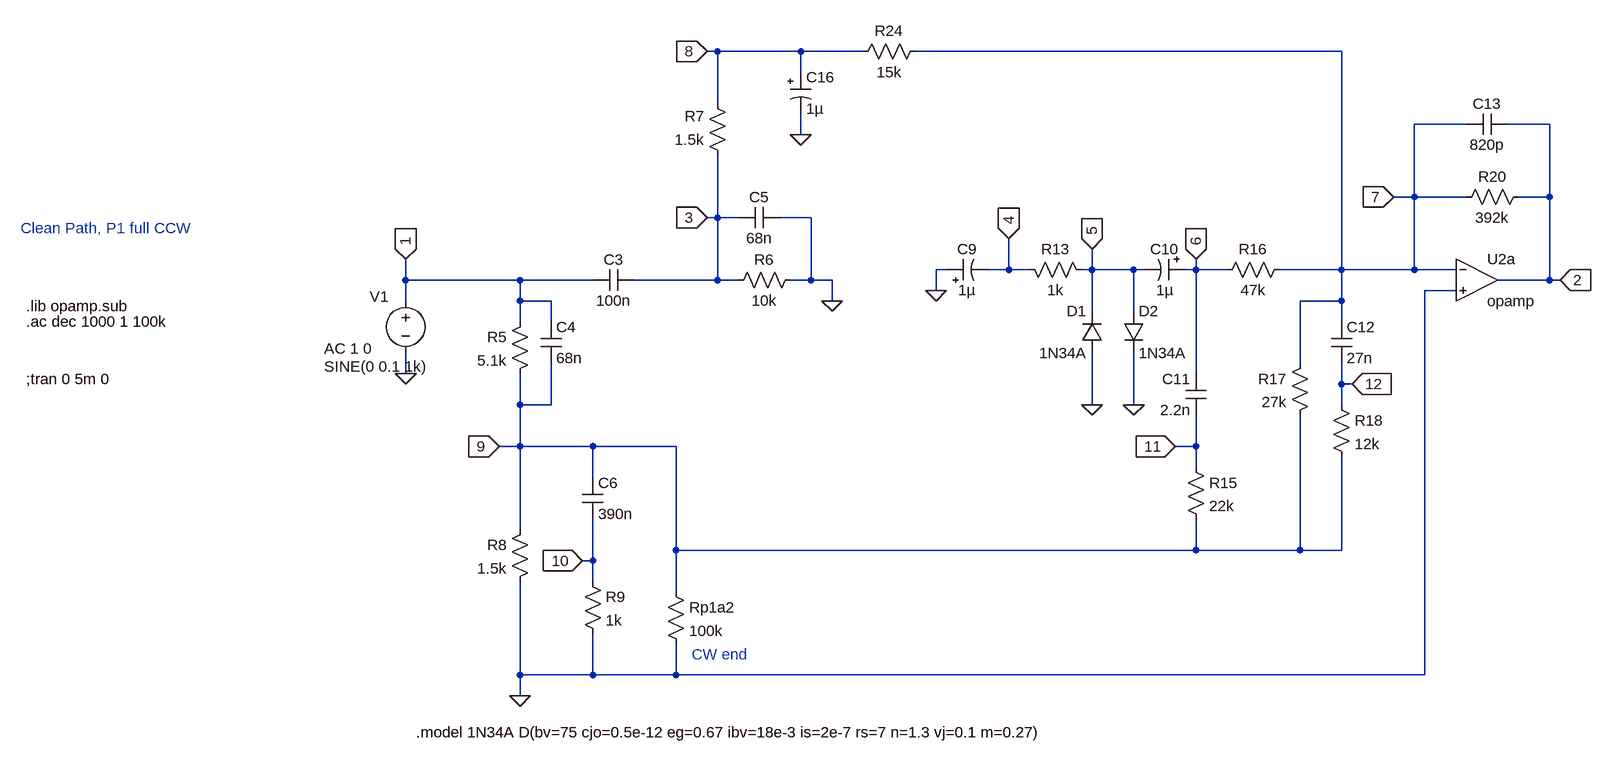
[diagram p0: schematic Klon-Centaur_clean_path_P1_full_ccw_v1.asc]
Klon-Centaur_clean_path_P1_full_ccw_v1.asc, the LTspice schematic file:
Version 4
SHEET 1 4496 5064
WIRE 96 2208 80 2208
WIRE 224 2208 96 2208
WIRE 320 2208 224 2208
WIRE 1056 2208 400 2208
WIRE 224 2240 224 2208
WIRE 96 2288 96 2208
WIRE 1248 2320 1168 2320
WIRE 1376 2320 1312 2320
WIRE 224 2336 224 2304
WIRE 1168 2432 1168 2320
WIRE 1168 2432 1136 2432
WIRE 1248 2432 1168 2432
WIRE 1376 2432 1376 2320
WIRE 1376 2432 1328 2432
WIRE 96 2464 96 2368
WIRE 96 2464 80 2464
WIRE 128 2464 96 2464
WIRE 240 2464 192 2464
WIRE 448 2544 432 2544
WIRE 544 2544 544 2496
WIRE 544 2544 512 2544
WIRE 576 2544 544 2544
WIRE 672 2544 672 2512
WIRE 672 2544 656 2544
WIRE 736 2544 672 2544
WIRE 752 2544 736 2544
WIRE 832 2544 832 2528
WIRE 832 2544 816 2544
WIRE 880 2544 832 2544
WIRE 1056 2544 1056 2208
WIRE 1056 2544 960 2544
WIRE 1168 2544 1168 2432
WIRE 1168 2544 1056 2544
WIRE 1232 2544 1168 2544
WIRE -384 2560 -384 2528
WIRE -208 2560 -384 2560
WIRE -96 2560 -208 2560
WIRE 96 2560 96 2464
WIRE 96 2560 -32 2560
WIRE 128 2560 96 2560
WIRE 240 2560 240 2464
WIRE 240 2560 208 2560
WIRE 272 2560 240 2560
WIRE 1376 2560 1376 2432
WIRE 1376 2560 1296 2560
WIRE 1392 2560 1376 2560
WIRE 432 2576 432 2544
WIRE 1232 2576 1184 2576
WIRE -384 2592 -384 2560
WIRE -208 2592 -208 2560
WIRE -160 2592 -208 2592
WIRE 272 2592 272 2560
WIRE 1056 2592 1056 2544
WIRE 1056 2592 992 2592
WIRE 672 2608 672 2544
WIRE 736 2608 736 2544
WIRE -208 2624 -208 2592
WIRE -160 2624 -160 2592
WIRE 1056 2624 1056 2592
WIRE 992 2688 992 2592
WIRE -384 2704 -384 2672
WIRE 832 2704 832 2544
WIRE 1056 2720 1056 2688
WIRE 1072 2720 1056 2720
WIRE -208 2752 -208 2704
WIRE -160 2752 -160 2688
WIRE -160 2752 -208 2752
WIRE 672 2752 672 2672
WIRE 736 2752 736 2672
WIRE 1056 2752 1056 2720
WIRE -208 2816 -208 2752
WIRE -208 2816 -240 2816
WIRE -96 2816 -208 2816
WIRE 32 2816 -96 2816
WIRE 832 2816 832 2768
WIRE 832 2816 800 2816
WIRE 832 2848 832 2816
WIRE -96 2864 -96 2816
WIRE -208 2944 -208 2816
WIRE 32 2976 32 2816
WIRE 832 2976 832 2928
WIRE 832 2976 32 2976
WIRE 992 2976 992 2768
WIRE 992 2976 832 2976
WIRE 1056 2976 1056 2832
WIRE 1056 2976 992 2976
WIRE -96 2992 -96 2928
WIRE -96 2992 -112 2992
WIRE -96 3024 -96 2992
WIRE 32 3040 32 2976
WIRE -208 3168 -208 3024
WIRE -96 3168 -96 3104
WIRE -96 3168 -208 3168
WIRE 32 3168 32 3120
WIRE 32 3168 -96 3168
WIRE 1184 3168 1184 2576
WIRE 1184 3168 32 3168
WIRE -208 3200 -208 3168
FLAG -384 2528 1
IOPIN -384 2528 In
FLAG 432 2576 0
FLAG 272 2592 0
FLAG 224 2336 0
FLAG 1392 2560 2
IOPIN 1392 2560 In
FLAG -208 3200 0
FLAG -384 2704 0
FLAG 80 2464 3
IOPIN 80 2464 In
FLAG 80 2208 8
IOPIN 80 2208 In
FLAG 544 2496 4
IOPIN 544 2496 In
FLAG 672 2512 5
IOPIN 672 2512 In
FLAG 832 2528 6
IOPIN 832 2528 In
FLAG 800 2816 11
IOPIN 800 2816 In
FLAG 1072 2720 12
IOPIN 1072 2720 In
FLAG -112 2992 10
IOPIN -112 2992 In
FLAG -240 2816 9
IOPIN -240 2816 In
FLAG 1136 2432 7
IOPIN 1136 2432 In
FLAG 736 2752 0
FLAG 672 2752 0
SYMBOL voltage -384 2576 R0
WINDOW 0 -55 9 Left 2
WINDOW 123 -125 89 Left 2
WINDOW 39 0 0 Left 0
WINDOW 3 -125 117 Left 2
SYMATTR InstName V1
SYMATTR Value2 AC 1 0
SYMATTR Value SINE(0 0.1 1k)
SYMBOL res -192 2608 M0
SYMATTR InstName R5
SYMATTR Value 5.1k
SYMBOL res -192 2928 M0
SYMATTR InstName R8
SYMATTR Value 1.5k
SYMBOL cap -32 2544 R90
WINDOW 0 0 32 VBottom 2
WINDOW 3 32 32 VTop 2
SYMATTR InstName C3
SYMATTR Value 100n
SYMBOL cap -176 2624 R0
SYMATTR InstName C4
SYMATTR Value 68n
SYMBOL cap -112 2864 R0
SYMATTR InstName C6
SYMATTR Value 390n
SYMBOL res -112 3008 R0
SYMATTR InstName R9
SYMATTR Value 1k
SYMBOL res 224 2544 R90
WINDOW 0 0 56 VBottom 2
WINDOW 3 32 56 VTop 2
SYMATTR InstName R6
SYMATTR Value 10k
SYMBOL cap 192 2448 R90
WINDOW 0 0 32 VBottom 2
WINDOW 3 32 32 VTop 2
SYMATTR InstName C5
SYMATTR Value 68n
SYMBOL res 16 3024 R0
SYMATTR InstName Rp1a2
SYMATTR Value 100k
SYMBOL res 672 2560 M270
WINDOW 0 32 56 VTop 2
WINDOW 3 0 56 VBottom 2
SYMATTR InstName R13
SYMATTR Value 1k
SYMBOL cap 848 2704 M0
SYMATTR InstName C11
SYMATTR Value 2.2n
SYMBOL res 816 2832 R0
SYMATTR InstName R15
SYMATTR Value 22k
SYMBOL res 1008 2672 M0
SYMATTR InstName R17
SYMATTR Value 27k
SYMBOL res 1040 2736 R0
SYMATTR InstName R18
SYMATTR Value 12k
SYMBOL cap 1040 2624 R0
SYMATTR InstName C12
SYMATTR Value 27n
SYMBOL res 976 2528 R90
WINDOW 0 0 56 VBottom 2
WINDOW 3 32 56 VTop 2
SYMATTR InstName R16
SYMATTR Value 47k
SYMBOL res 112 2384 R180
WINDOW 0 36 76 Left 2
WINDOW 3 36 40 Left 2
SYMATTR InstName R7
SYMATTR Value 1.5k
SYMBOL res 416 2192 R90
WINDOW 0 0 56 VBottom 2
WINDOW 3 32 56 VTop 2
SYMATTR InstName R24
SYMATTR Value 15k
SYMBOL res 1344 2416 R90
WINDOW 0 0 56 VBottom 2
WINDOW 3 32 56 VTop 2
SYMATTR InstName R20
SYMATTR Value 392k
SYMBOL cap 1312 2304 R90
WINDOW 0 0 32 VBottom 2
WINDOW 3 32 32 VTop 2
SYMATTR InstName C13
SYMATTR Value 820p
SYMBOL OpAmps\\opamp 1264 2496 R0
SYMATTR InstName U2a
SYMBOL polcap 208 2240 R0
SYMATTR InstName C16
SYMATTR Value 1µ
SYMBOL polcap 448 2560 R270
WINDOW 0 32 32 VTop 2
WINDOW 3 0 32 VBottom 2
SYMATTR InstName C9
SYMATTR Value 1µ
SYMBOL polcap 816 2528 R90
WINDOW 0 0 32 VBottom 2
WINDOW 3 32 32 VTop 2
SYMATTR InstName C10
SYMATTR Value 1µ
SYMBOL diode 688 2672 R180
WINDOW 0 24 64 Left 2
WINDOW 3 24 0 Left 2
SYMATTR InstName D1
SYMATTR Value 1N34A
SYMBOL diode 720 2608 R0
SYMATTR InstName D2
SYMATTR Value 1N34A
TEXT -968 2600 Left 2 !.lib opamp.sub
TEXT -968 2624 Left 2 !.ac dec 1000 1 100k
TEXT 56 3136 Left 2 ;CW end
TEXT -968 2712 Left 2 !;tran 0 5m 0
TEXT -976 2480 Left 2 ;Clean Path, P1 full CCW
TEXT -368 3256 Left 2 !.model 1N34A D(bv=75 cjo=0.5e-12 eg=0.67 ibv=18e-3 is=2e-7 rs=7 n=1.3 vj=0.1 m=0.27)

The netlist it stands for:
* Klon-Centaur_clean_path_P1_full_ccw_v1.asc
V1 1 0 SINE(0 0.1 1k) AC 1 0
R5 1 9 5.1k
R8 9 0 1.5k
C3 3 1 100n
C4 1 9 68n
C6 9 10 390n
R9 10 0 1k
R6 0 3 10k
C5 0 3 68n
Rp1a2 9 0 100k
R13 5 4 1k
C11 6 11 2.2n
R15 11 9 22k
R17 7 9 27k
R18 12 9 12k
C12 7 12 27n
R16 7 6 47k
R7 3 8 1.5k
R24 7 8 15k
R20 2 7 392k
C13 2 7 820p
XU2a 7 0 2 opamp Aol=100K GBW=10Meg  ; pins invin noninvin out
C16 8 0 1µ
C9 0 4 1µ
C10 6 5 1µ
D1 0 5 1N34A
D2 5 0 1N34A
.model D D
.lib standard.dio
.lib opamp.sub
.ac dec 1000 1 100k
* CW end
;tran 0 5m 0
* Clean Path, P1 full CCW
.model 1N34A D(bv=75 cjo=0.5e-12 eg=0.67 ibv=18e-3 is=2e-7 rs=7 n=1.3 vj=0.1 m=0.27)
.backanno
.end